# EAGLE schematic schematics (EAGLE 9.2.2)
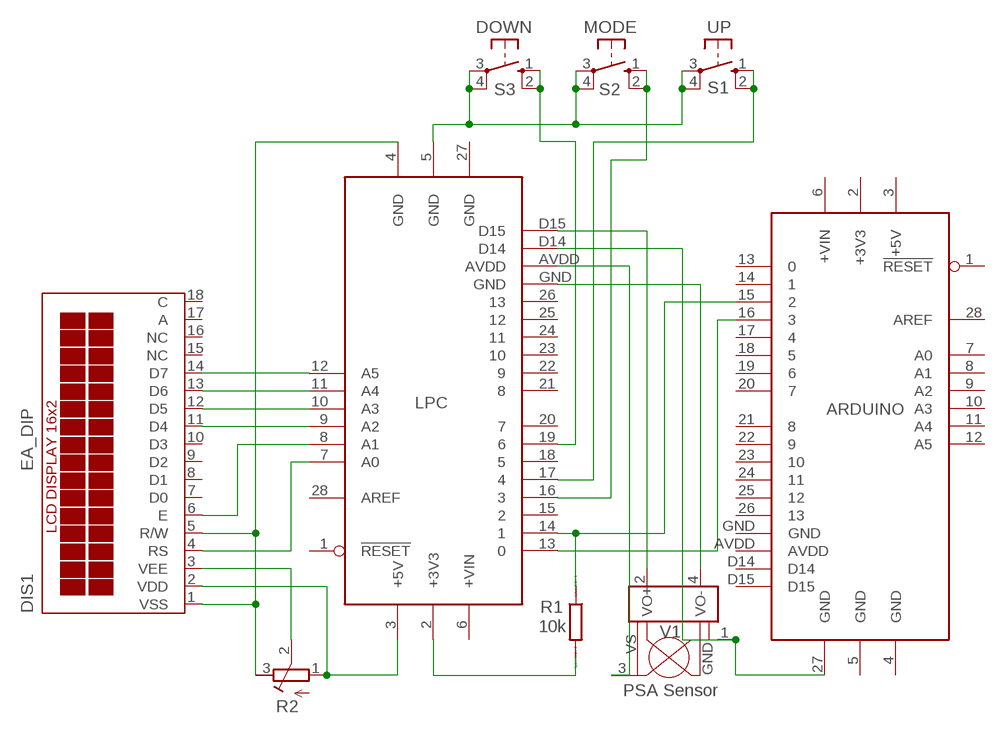
[diagram p0: schematic, sheet 1]

## Parts
ARDUINO  ARDUINO2009_10  [ARDUINO2009]
DIS1  EA_DIP  [EA_DIP]
LPC  ARDUINO2009_10  [ARDUINO2009]
R1  10k  R0207/10  [0207/10]
R2  R-TRIMM64W  [RTRIM64W]
S1  UP  10-XX  [B3F-10XX]
S2  MODE  10-XX  [B3F-10XX]
S3  DOWN  10-XX  [B3F-10XX]
V1  PSA Sensor  MPX2050DPH  [MPX2050DPH]

## Nets
N$1: DIS1.14(D7) LPC.12(A5)
N$2: DIS1.13(D6) LPC.11(A4)
N$3: DIS1.12(D5) LPC.10(A3)
N$4: DIS1.11(D4) LPC.9(A2)
N$5: DIS1.6(E) LPC.8(A1)
N$6: DIS1.1(VSS) DIS1.5(R/W) LPC.4(GND) R2.3(E)
N$7: DIS1.4(RS) LPC.7(A0)
N$8: DIS1.3(VEE) R2.2(S)
N$9: ARDUINO.16 LPC.13
N$10: DIS1.2(VDD) LPC.3(+5V) R2.1(A)
N$11: ARDUINO.15 LPC.14 R1.1
N$12: LPC.5(GND) S1.3(P) S1.4(P1) S2.3(P) S2.4(P1) S3.3(P) S3.4(P1)
N$13: LPC.2(+3V3) R1.2
N$14: LPC.16 S2.1(S) S2.2(S1)
N$15: LPC.17 S1.1(S) S1.2(S1)
N$16: LPC.19 S3.1(S) S3.2(S1)
N$17: LPC.D15 V1.2(VO+)
N$18: LPC.GND V1.4(VO-)
N$19: LPC.AVDD V1.3(VS)
N$20: ARDUINO.27(GND) LPC.D14 V1.1(GND)
Unconnected: ARDUINO.1(!RESET) ARDUINO.6(+VIN) ARDUINO.7(A0) ARDUINO.8(A1) ARDUINO.9(A2) ARDUINO.10(A3) ARDUINO.11(A4) ARDUINO.12(A5) ARDUINO.13 ARDUINO.14 ARDUINO.17 ARDUINO.18 ARDUINO.19 ARDUINO.20 ARDUINO.21 ARDUINO.22 ARDUINO.23 ARDUINO.24 ARDUINO.25 ARDUINO.26 ARDUINO.28(AREF) ARDUINO.AVDD ARDUINO.D14 ARDUINO.D15 ARDUINO.GND DIS1.7(D0) DIS1.8(D1) DIS1.9(D2) DIS1.10(D3) DIS1.15(NC) DIS1.16(NC) DIS1.17(A) DIS1.18(C) LPC.1(!RESET) LPC.6(+VIN) LPC.15 LPC.18 LPC.20 LPC.21 LPC.22 LPC.23 LPC.24 LPC.25 LPC.26 LPC.28(AREF)

## Power pins joined to a net without a drawn wire
+3V3: ARDUINO.2(+3V3)
+5V: ARDUINO.3(+5V)
GND: ARDUINO.4(GND) ARDUINO.5(GND) LPC.27(GND)

## Library data of the parts
ARDUINO LPC = arduino:ARDUINO2009_1: The Arduino Duemilanove ("2009") is a microcontroller board based on the ATmega168 or ATmega328. - 14 digital input/output pins (of which 6 can be used as PWM outputs) - 6 analog inputs, a 16 MHz crystal oscillator - USB connection - power jack - ISP header - reset button It contains everything needed to support the microcontroller; simply connect it to a computer with a USB cable or power it with a AC-to-DC adapter or battery to get started http://arduino.cc/en/Main/ArduinoBoardDuemilanove
DIS1 = display-lcd:EA_DIP: LCD-MODUL 2x16 - 6,68mm, INKL. KONTROLLER HD44780 Source: Data sheet <http://www.lcd-module.de/pdf/doma/dip162-d.pdf>
R1 = eagle-ltspice:R: RESISTOR, European symbol; SPICEMODEL: NONE; SPICEPREFIX: R
R2 = rcl:R-TRIMM: Trimm resistor; SPICEMODEL: X; SPICEPREFIXL: POT
S1-S3 = switch-omron:10-XX: OMRON SWITCH; MPN: B3F-1000; OC_FARNELL: 176432; OC_NEWARK: 36M3542
V1 = motorola-sensor-driver:MPX2050*: 50 kPa Pressure Sensor On-Chip Temparetur Compensated & Calibrated Silicon Pressure Sensor; OC_FARNELL: unknown; OC_NEWARK: unknown